# Altium schematic sheet MotorDrivers.SchDoc
size A4; SheetNumber: 5; SheetTotal: 10
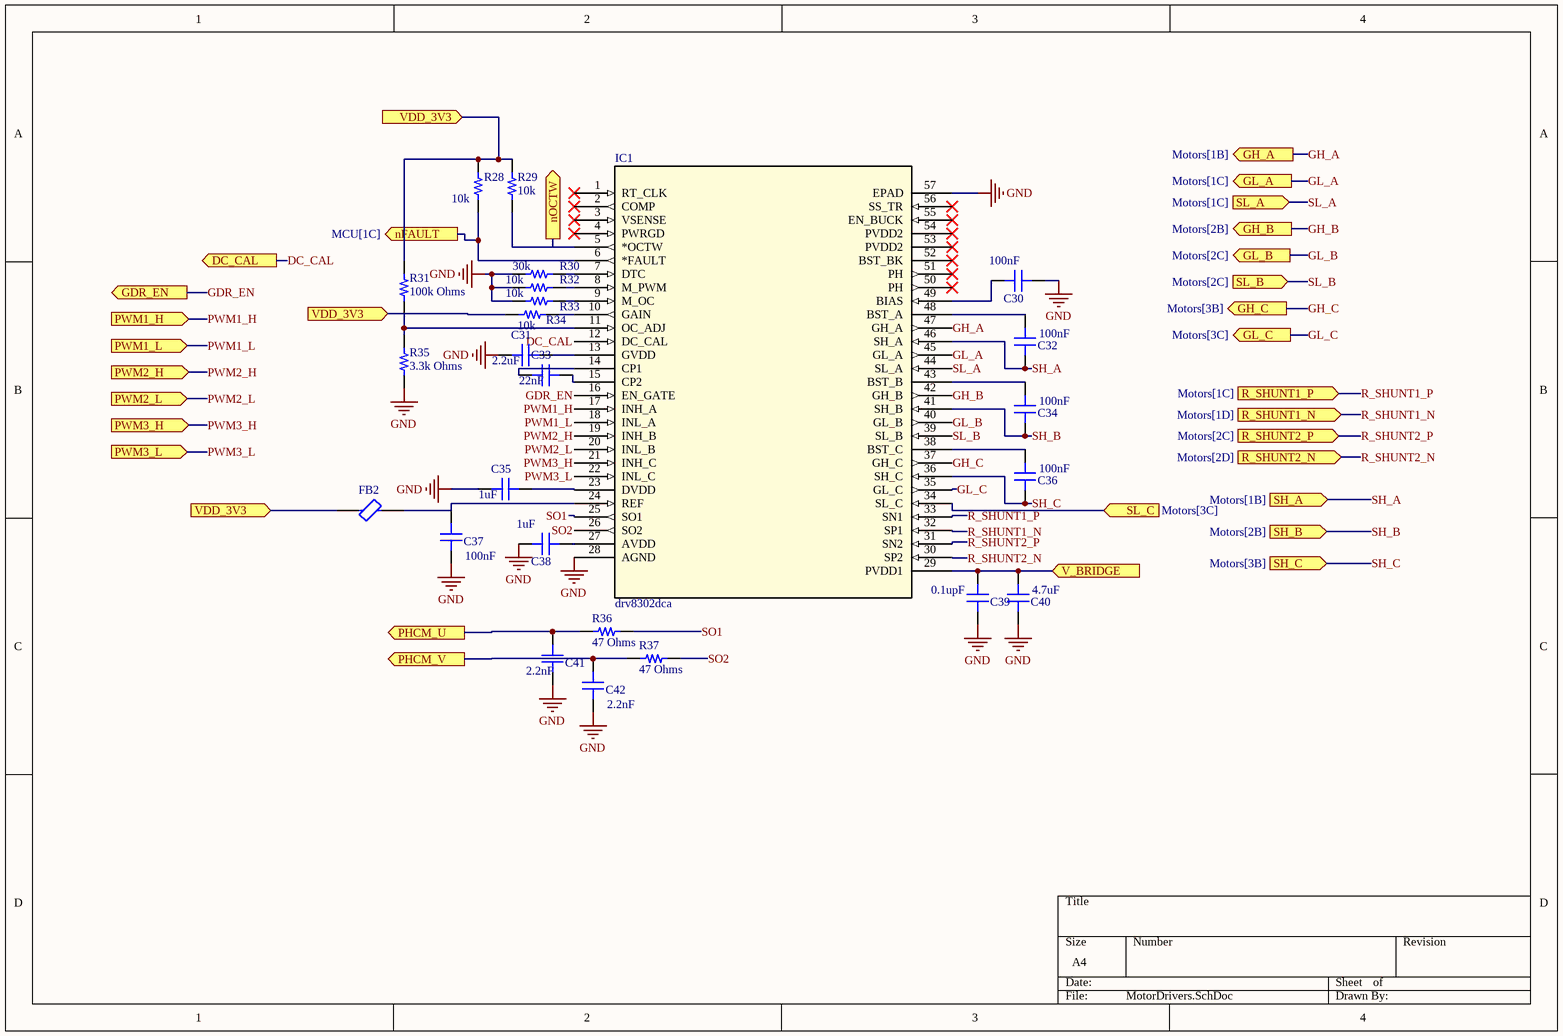
[diagram p0: MotorDrivers.SchDoc]

## Parts
C30  100nF  [CAP 0603_1608]
C31  2.2uF  [CAP 0603_1608]
C32  100nF  [CAP 0603_1608]
C33  22nF  [CAP 0603_1608]
C34  100nF  [CAP 0603_1608]
C35  1uF  [CAP 0603_1608]
C36  100nF  [CAP 0603_1608]
C37  100nF  [CAP 0603_1608]
C38  1uF  [CAP 0603_1608]
C39  0.1upF  [CAP 0603_1608]
C40  4.7uF  [CAP 0603_1608]
C41  2.2nF  [CAP 0603_1608]
C42  2.2nF  [CAP 0603_1608]
FB2  MPZ2012S601AT000  [FP-MPZ2012-MFG]  (value not drawn)
IC1  drv8302dca  [drv8302dca]
R28  10k  [RES 0402_1005]
R29  10k  [RES 0402_1005]
R30  30k  [RES 0402_1005]
R31  100k Ohms  [RES 0402_1005]
R32  10k  [RES 0402_1005]
R33  10k  [RES 0402_1005]
R34  10k  [RES 0402_1005]
R35  3.3k Ohms  [RES 0402_1005]
R36  47 Ohms  [RES 0402_1005]
R37  47 Ohms  [RES 0402_1005]

## Ports
DC_CAL (out, see MCU[3B]), GDR_EN (out, see MCU[3B], Power[2D]), GH_A (out, see Motors[1B]), GH_B (out, see Motors[2B]), GH_C (out, see Motors[3B]), GL_A (out, see Motors[1C]), GL_B (out, see Motors[2C]), GL_C (out, see Motors[3C]), nFAULT (out, see MCU[1C]), nOCTW (out, see MCU[1C]), PHCM_U (out, see ADC_Input_protection[2B], MCU[3B]), PHCM_V (out, see ADC_Input_protection[3B], MCU[3B]), PWM1_H (in, see MCU[3B]), PWM1_L (in, see MCU[3C]), PWM2_H (in, see MCU[3B]), PWM2_L (in, see MCU[3C]), PWM3_H (in, see MCU[3B]), PWM3_L (in, see MCU[3D]), R_SHUNT1_N (in, see Motors[1D]), R_SHUNT1_P (in, see Motors[1C]), R_SHUNT2_N (in, see Motors[2D]), R_SHUNT2_P (in, see Motors[2C]), SH_A (in, see Motors[1B]), SH_B (in, see Motors[2B]), SH_C (in, see Motors[3B]), SL_A (in, see Motors[1C]), SL_B (in, see Motors[2C]), SL_C (in, see Motors[3C]), V_BRIDGE (in, see DC-DC_Buck_Converter+12Vto+3.3V[1A], DC_Current_Voltage_Measurement[3B], Motors[1A], Power[4A]), VDD_3V3 (in, see ADC_Input_protection[3C], DC-DC_Buck_Converter+12Vto+3.3V[3C], DC_Current_Voltage_Measurement[3B], MCU[1B], MotorDrivers[1A], MotorDrivers[1B], Power[2C], ZeroCrossing[1A]), VDD_3V3 (in, see ADC_Input_protection[3C], DC-DC_Buck_Converter+12Vto+3.3V[3C], DC_Current_Voltage_Measurement[3B], MCU[1B], MotorDrivers[1B], Power[2C], ZeroCrossing[1A])

## Nets
GND: C30.2 C31.1 C35.1 C37.2 C38.2 C39.1 C40.1 C41.2 C42.2 IC1.28(AGND) IC1.57(EPAD) R30.1 R32.1 R33.1 R35.2
DC_CAL: IC1.12(DC_CAL) ; port DC_CAL
GDR_EN: IC1.16(EN_GATE) ; port GDR_EN
GH_A: IC1.47(GH_A) ; port GH_A
GH_B: IC1.42(GH_B) ; port GH_B
GH_C: IC1.37(GH_C) ; port GH_C
GL_A: IC1.45(GL_A) ; port GL_A
GL_B: IC1.40(GL_B) ; port GL_B
GL_C: IC1.35(GL_C) ; port GL_C
nFAULT: IC1.6(*FAULT) R28.2 ; port nFAULT
nOCTW: IC1.5(*OCTW) R29.2 ; port nOCTW
PHCM_U: C41.1 R36.1 ; port PHCM_U
PHCM_V: C42.1 R37.1 ; port PHCM_V
PWM1_H: IC1.17(INH_A) ; port PWM1_H
PWM1_L: IC1.18(INL_A) ; port PWM1_L
PWM2_H: IC1.19(INH_B) ; port PWM2_H
PWM2_L: IC1.20(INL_B) ; port PWM2_L
PWM3_H: IC1.21(INH_C) ; port PWM3_H
PWM3_L: IC1.22(INL_C) ; port PWM3_L
R_SHUNT1_N: IC1.32(SP1) ; port R_SHUNT1_N
R_SHUNT1_P: IC1.33(SN1) ; port R_SHUNT1_P
R_SHUNT2_N: IC1.30(SP2) ; port R_SHUNT2_N
R_SHUNT2_P: IC1.31(SN2) ; port R_SHUNT2_P
SH_A: C32.1 IC1.46(SH_A) ; port SH_A
SH_B: C34.1 IC1.41(SH_B) ; port SH_B
SH_C: C36.1 IC1.36(SH_C) ; port SH_C
SL_A: IC1.44(SL_A) ; port SL_A
SL_B: IC1.39(SL_B) ; port SL_B
SL_C: IC1.34(SL_C) ; port SL_C
SO1: IC1.25(SO1) R36.2
SO2: IC1.26(SO2) R37.2
V_BRIDGE: C39.2 C40.2 IC1.29(PVDD1) ; port V_BRIDGE
VDD_3V3: FB2.1 R28.1 R29.1 R31.1 R34.1 ; port VDD_3V3
NetC30_1: C30.1 IC1.49(BIAS)
NetC31_2: C31.2 IC1.13(GVDD)
NetC32_2: C32.2 IC1.48(BST_A)
NetC33_1: C33.1 IC1.14(CP1)
NetC33_2: C33.2 IC1.15(CP2)
NetC34_2: C34.2 IC1.43(BST_B)
NetC35_2: C35.2 IC1.23(DVDD)
NetC36_2: C36.2 IC1.38(BST_C)
NetC37_1: C37.1 FB2.2 IC1.24(REF)
NetC38_1: C38.1 IC1.27(AVDD)
NetIC1_7: IC1.7(DTC) R30.2
NetIC1_8: IC1.8(M_PWM) R32.2
NetIC1_9: IC1.9(M_OC) R33.2
NetIC1_10: IC1.10(GAIN) R34.2
NetIC1_11: IC1.11(OC_ADJ) R31.2 R35.1

Not connected (* = marked no-connect by the designer): IC1 1(RT_CLK)* 2(COMP)* 3(VSENSE)* 4(PWRGD)* 50(PH)* 51(PH)* 52(BST_BK)* 53(PVDD2)* 54(PVDD2)* 55(EN_BUCK)* 56(SS_TR)*

## Library data of the parts
C30 C32 C34 C36-C38 C40-C42 = 0603ZC102KAT2A: CAP CER 1000PF 10V X7R 0603; manufacturer: AVX Corporation; Tolerance: ±10%; Part Number: 0603ZC102KAT2A; Applications: General Purpose; componentlink1description: Datasheet; componentlink1url: http://datasheets.avx.com/X7RDielectric.pdf; componentlink2description: DigiKey Link; componentlink2url: http://digikey.com/product-detail/en/avx-corporation/0603ZC102KAT2A/478-0603ZC102KAT2ACT-ND/11570315; Device Package: 0603 (1608 Metric); lastupdated: 2.09.2020 01:02:55; Lifecycle Status: Active; Minimum Order: 1; Mounting Type: Surface Mount, MLCC; Operating Temperature: -55°C ~ 125°C; Package / Case: 0603 (1608 Metric); packaging: TapeAndReel; partid: 27370; Part Status: Active; price: 0.01; series: -; Supplier 1: DigiKey; Supplier Part Number 1: 478-0603ZC102KAT2ACT-ND; Temperature Coefficient: X7R; Voltage - Rated: 10V
  C30 C32 C34 C36 C37: Value: 100nF; Capacitance: 100nF
  C38: Value: 1uF; Capacitance: 1uF
  C40: Value: 4.7uF; Capacitance: 4.7uF
  C41 C42: Value: 2.2nF; Capacitance: 2.2nF
C31 C33 C35 = 0603ZC102KAT2A: CAP CER 1000PF 10V X7R 0603; manufacturer: AVX Corporation; Capacitance: 2.2nF; Tolerance: ±10%; Part Number: 0603ZC102KAT2A; Applications: General Purpose; componentlink1description: Datasheet; componentlink1url: http://datasheets.avx.com/X7RDielectric.pdf; componentlink2description: DigiKey Link; componentlink2url: http://digikey.com/product-detail/en/avx-corporation/0603ZC102KAT2A/478-0603ZC102KAT2ACT-ND/11570315; Device Package: 0603 (1608 Metric); lastupdated: 2.09.2020 01:02:55; Lifecycle Status: Active; Minimum Order: 1; Mounting Type: Surface Mount, MLCC; Operating Temperature: -55°C ~ 125°C; Package / Case: 0603 (1608 Metric); packaging: TapeAndReel; partid: 27370; Part Status: Active; price: 0.01; series: -; Supplier 1: DigiKey; Supplier Part Number 1: 478-0603ZC102KAT2ACT-ND; Temperature Coefficient: X7R; Voltage - Rated: 10V
  C31: Value: 2.2uF
  C33: Value: 22nF
  C35: Value: 1uF
C39 = 0603ZC102KAT2A: CAP CER 1000PF 10V X7R 0603; manufacturer: AVX Corporation; Capacitance: 0.1uF; Tolerance: ±10%; Part Number: 0603ZC102KAT2A; Value: 0.1upF; Applications: General Purpose; componentlink1description: Datasheet; componentlink1url: http://datasheets.avx.com/X7RDielectric.pdf; componentlink2description: DigiKey Link; componentlink2url: http://digikey.com/product-detail/en/avx-corporation/0603ZC102KAT2A/478-0603ZC102KAT2ACT-ND/11570315; Device Package: 0603 (1608 Metric); lastupdated: 2.09.2020 01:02:55; Lifecycle Status: Active; Minimum Order: 1; Mounting Type: Surface Mount, MLCC; Operating Temperature: -55°C ~ 125°C; Package / Case: 0603 (1608 Metric); packaging: TapeAndReel; partid: 27370; Part Status: Active; price: 0.01; series: -; Supplier 1: DigiKey; Supplier Part Number 1: 478-0603ZC102KAT2ACT-ND; Temperature Coefficient: X7R; Voltage - Rated: 10V
FB2 = CMP-2000-05401-2: Manufacturer Lifecycle Status: PRODUCTION; NexarPartId: 12090955; RMS Current (Irms): 2A; Test Frequency: 100MHz; Tolerance: 25%; Core Material: Ferrite; Series Resistance: 100mΩ; Impedance: 600Ω; Packaging: Digi-Reel®; Length: 2mm; Min Operating Temperature: -55°C; Width: 1.25mm; Max Width: 1.45mm; Lead Free: Lead Free; Current Rating: 2A; Case Code (Imperial): 0805; Min Length: 1.8mm; Schedule B: 8504500000, 8504500000; REACH SVHC: No SVHC; Case Code (Metric): 2012; Max DC Current: 2A; Case/Package: 0805; Lifecycle Status: Production; Min Width: 1.05mm; Mount: Surface Mount; Height: 1.0414mm; Resistance: 100mΩ; DC Resistance (DCR): 100mΩ; Max Operating Temperature: 125°C; Max Length: 2.2mm; RoHS: Compliant
R28 R29 R32-R34 = ESR01MZPF47R0: ANTI-SURGE CHIP RESISTORS; Manufacturer: Rohm Semiconductor; Power (Watts): 0.2W, 1/5W; Resistance: 10k Ohms; Temperature Coefficient: ±100ppm/°C; Tolerance: ±1%; Part Number: ESR01MZPF47R0; Value: 10k; ComponentLink1Description: Datasheet; ComponentLink1URL: https://fscdn.rohm.com/en/products/databook/datasheet/passive/resistor/chip_resistor/esr-e.pdf; ComponentLink2Description: DigiKey Link; ComponentLink2URL: https://www.digikey.com/en/products/detail/rohm-semiconductor/ESR01MZPF47R0/16180187; Composition: Thick Film; Device Package: 0402 (1005 Metric); Features: Automotive AEC-Q200, Pulse Withstanding; Height - Seated (Max): 0.016" (0.40mm); LastUpdated: 5.10.2023 19:23:22; Lifecycle Status: Active; Minimum Order: 1; Number of Terminations: 2; Operating Temperature: -55°C ~ 155°C; Package / Case: 0402 (1005 Metric); Packaging: TapeAndReel; PartId: 67421; Part Status: Active; Price: 0.03; Ratings: AEC-Q200; Series: ESR; Size / Dimension: 0.039" L x 0.020" W (1.00mm x 0.50mm); Supplier 1: DigiKey; Supplier Part Number 1: 511-ESR01MZPF47R0CT-ND; Supplier Device Package: 0402
R30 = ESR01MZPF47R0: ANTI-SURGE CHIP RESISTORS; Manufacturer: Rohm Semiconductor; Power (Watts): 0.2W, 1/5W; Resistance: 30k Ohms; Temperature Coefficient: ±100ppm/°C; Tolerance: ±1%; Part Number: ESR01MZPF47R0; Value: 30k; ComponentLink1Description: Datasheet; ComponentLink1URL: https://fscdn.rohm.com/en/products/databook/datasheet/passive/resistor/chip_resistor/esr-e.pdf; ComponentLink2Description: DigiKey Link; ComponentLink2URL: https://www.digikey.com/en/products/detail/rohm-semiconductor/ESR01MZPF47R0/16180187; Composition: Thick Film; Device Package: 0402 (1005 Metric); Features: Automotive AEC-Q200, Pulse Withstanding; Height - Seated (Max): 0.016" (0.40mm); LastUpdated: 5.10.2023 19:23:22; Lifecycle Status: Active; Minimum Order: 1; Number of Terminations: 2; Operating Temperature: -55°C ~ 155°C; Package / Case: 0402 (1005 Metric); Packaging: TapeAndReel; PartId: 67421; Part Status: Active; Price: 0.03; Ratings: AEC-Q200; Series: ESR; Size / Dimension: 0.039" L x 0.020" W (1.00mm x 0.50mm); Supplier 1: DigiKey; Supplier Part Number 1: 511-ESR01MZPF47R0CT-ND; Supplier Device Package: 0402
R31 R35 = ESR01MZPF47R0: ANTI-SURGE CHIP RESISTORS; Manufacturer: Rohm Semiconductor; Power (Watts): 0.2W, 1/5W; Resistance: 47 Ohms; Temperature Coefficient: ±100ppm/°C; Tolerance: ±1%; Part Number: ESR01MZPF47R0; ComponentLink1Description: Datasheet; ComponentLink1URL: https://fscdn.rohm.com/en/products/databook/datasheet/passive/resistor/chip_resistor/esr-e.pdf; ComponentLink2Description: DigiKey Link; ComponentLink2URL: https://www.digikey.com/en/products/detail/rohm-semiconductor/ESR01MZPF47R0/16180187; Composition: Thick Film; Device Package: 0402 (1005 Metric); Features: Automotive AEC-Q200, Pulse Withstanding; Height - Seated (Max): 0.016" (0.40mm); LastUpdated: 5.10.2023 19:23:22; Lifecycle Status: Active; Minimum Order: 1; Number of Terminations: 2; Operating Temperature: -55°C ~ 155°C; Package / Case: 0402 (1005 Metric); Packaging: TapeAndReel; PartId: 67421; Part Status: Active; Price: 0.03; Ratings: AEC-Q200; Series: ESR; Size / Dimension: 0.039" L x 0.020" W (1.00mm x 0.50mm); Supplier 1: DigiKey; Supplier Part Number 1: 511-ESR01MZPF47R0CT-ND; Supplier Device Package: 0402
  R31: Value: 100k Ohms
  R35: Value: 3.3k Ohms
R36 R37 = ESR01MZPF47R0: ANTI-SURGE CHIP RESISTORS; Manufacturer: Rohm Semiconductor; Power (Watts): 0.2W, 1/5W; Temperature Coefficient: ±100ppm/°C; Tolerance: ±1%; Part Number: ESR01MZPF47R0; Value: 47 Ohms; ComponentLink1Description: Datasheet; ComponentLink1URL: https://fscdn.rohm.com/en/products/databook/datasheet/passive/resistor/chip_resistor/esr-e.pdf; ComponentLink2Description: DigiKey Link; ComponentLink2URL: https://www.digikey.com/en/products/detail/rohm-semiconductor/ESR01MZPF47R0/16180187; Composition: Thick Film; Device Package: 0402 (1005 Metric); Features: Automotive AEC-Q200, Pulse Withstanding; Height - Seated (Max): 0.016" (0.40mm); LastUpdated: 5.10.2023 19:23:22; Lifecycle Status: Active; Minimum Order: 1; Number of Terminations: 2; Operating Temperature: -55°C ~ 155°C; Package / Case: 0402 (1005 Metric); Packaging: TapeAndReel; PartId: 67421; Part Status: Active; Price: 0.03; Ratings: AEC-Q200; Resistance: 47 Ohms; Series: ESR; Size / Dimension: 0.039" L x 0.020" W (1.00mm x 0.50mm); Supplier 1: DigiKey; Supplier Part Number 1: 511-ESR01MZPF47R0CT-ND; Supplier Device Package: 0402